# Altium schematic sheet PAGE11.SchDoc
size 246 x 182 mm
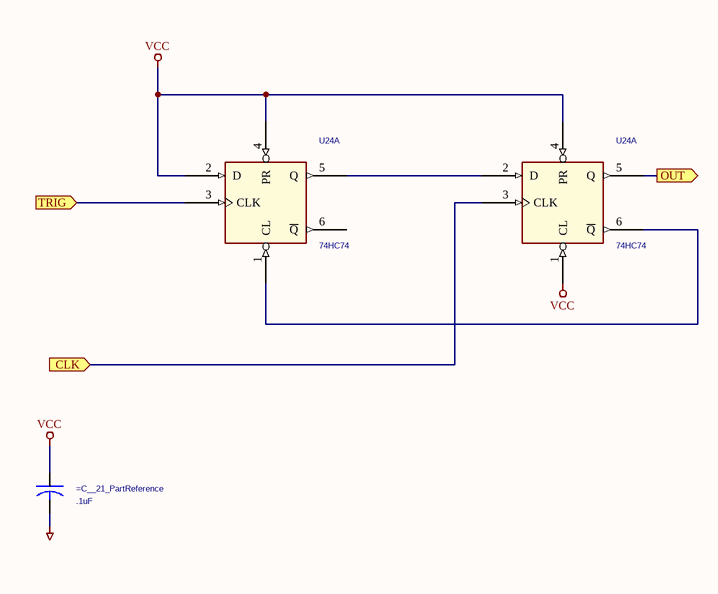
[diagram p0: PAGE11.SchDoc]

## Parts
(Parts that share a designator on the sheet are numbered #1, #2 ... from top to bottom, then left to right.)
=C__21_PartReference  .1uF  [AXIALCAP0.3]
U24#1  74HC74  [DIP14]  (part A of 2)
U24#2  74HC74  [DIP14]  (part A of 2)

## Ports
CLK (in), OUT (out), TRIG (in)

## Nets
AGND: =C__21_PartReference.2
GND: U24#1.7(GND) U24#2.7(GND)
VCC: =C__21_PartReference.1 U24#1.2(D) U24#1.4(PR) U24#1.14(VCC) U24#2.1(CL) U24#2.4(PR) U24#2.14(VCC)
CLK: U24#2.3(CLK) ; port CLK
OUT: U24#2.5(Q) ; port OUT
TRIG: U24#1.3(CLK) ; port TRIG
NetU24#1_1: U24#1.1(CL) U24#2.6(~{Q})
NetU24#1_5: U24#1.5(Q) U24#2.2(D)

Not connected (* = marked no-connect by the designer): U24#1 6(~{Q})

## Library data of the parts
=C__21_PartReference = CAP_Dup1: PART NO: 80-C410C104M5U